# EAGLE design TBController_Teensy_3_2 (EAGLE 6.5.0)
COMPANY: ADAFRUIT INDUSTRIES; DRAWN: KTOWN; REV: B
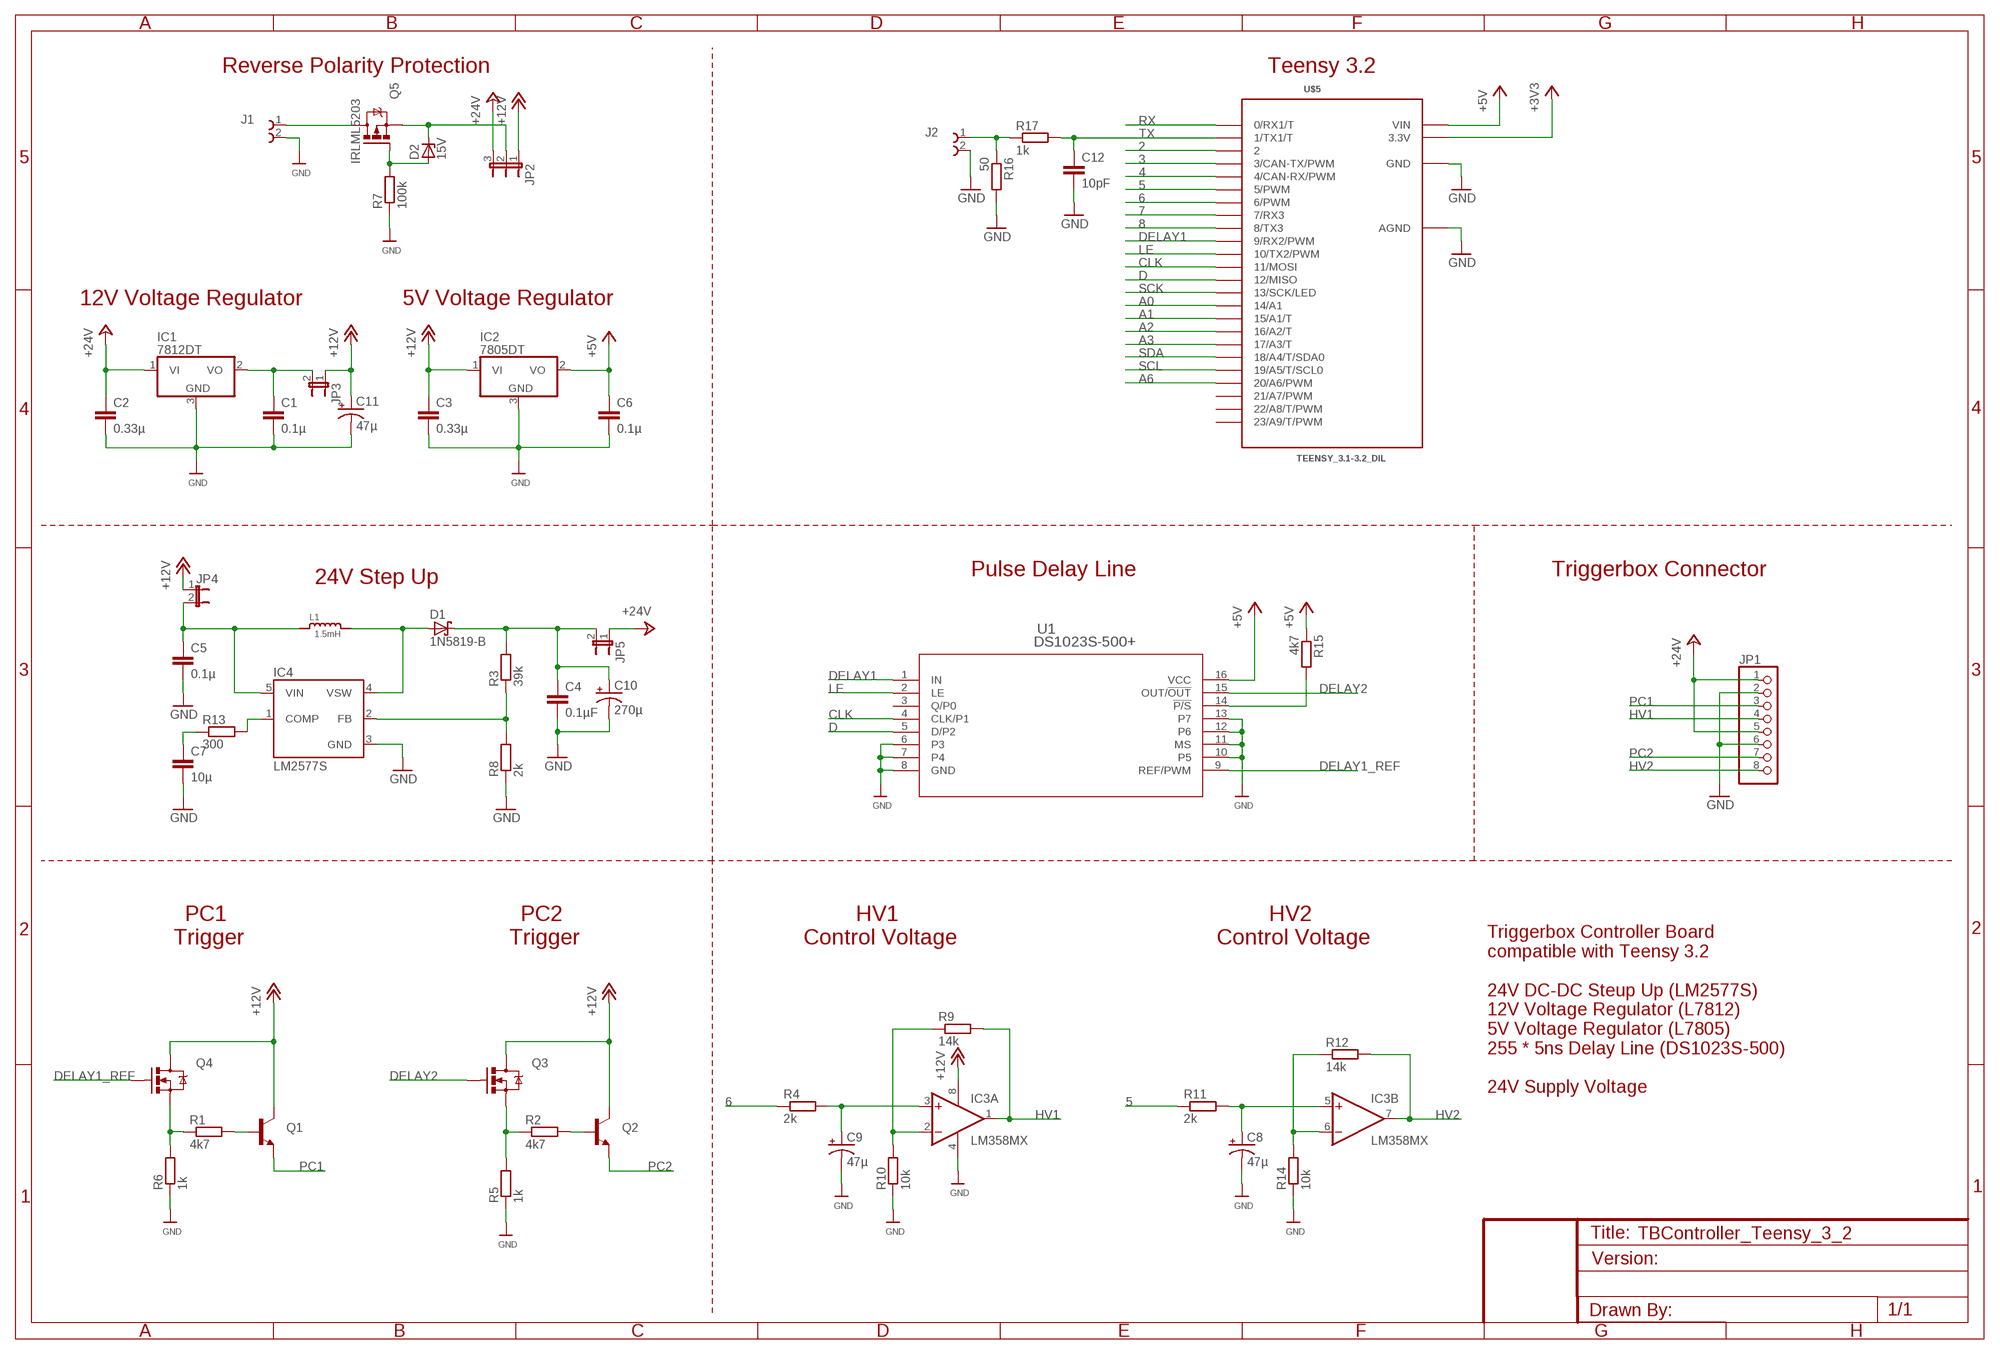
[diagram p0: schematic, sheet 1]

## Parts
C1  0.1µ  C-EUC0805K  [C0805K]
C2  0.33µ  C-EUC0805K  [C0805K]
C3  0.33µ  C-EUC0805K  [C0805K]
C4  0.1µF  C-EUC0805K  [C0805K]
C5  0.1µ  C-EUC0805K  [C0805K]
C6  0.1µ  C-EUC0805K  [C0805K]
C7  10µ  C-EUC0805K  [C0805K]
C8  47µ  CAP_POLPTH1  [CPOL-RADIAL-100UF-25V]
C9  47µ  CAP_POLPTH1  [CPOL-RADIAL-100UF-25V]
C10  270µ  CAP_POLPTH1  [CPOL-RADIAL-100UF-25V]
C11  47µ  CAP_POLPTH1  [CPOL-RADIAL-100UF-25V]
C12  10pF  C-EUC0805K  [C0805K]
D1  1N5819-B  [DO41-7.6]
D2  15V  ZENER-DIODESOT23  [SOT23]
IC1  7812DT  [TO252]
IC2  7805DT  [TO252]
IC3  LM358MX  [SO08]
IC4  LM2577S  [TO263-5]
J1  691103110002  [691103110002]
J2  691103110002  [691103110002]
JP1  PINHD-1X8  [1X08]
JP2  JP2E  [JP2]
JP3  JUMPER-2PTH_LOCK  [1X02_LOCK]
JP4  JUMPER-2PTH_LOCK  [1X02_LOCK]
JP5  JUMPER-2PTH_LOCK  [1X02_LOCK]
L1  1.5mH  SPULE  [WUERTH_WE_PD]
Q1  TRANSISTOR_NPNSOT23  [SOT23]
Q2  TRANSISTOR_NPNSOT23  [SOT23]
Q3  MOSFET-NCHANNELSMD  [SOT23-3]
Q4  MOSFET-NCHANNELSMD  [SOT23-3]
Q5  IRLML5203  [MICRO3]
R1  4k7  R-EU_R0805  [R0805]
R2  4k7  R-EU_R0805  [R0805]
R3  39k  R-EU_R0805  [R0805]
R4  2k  R-EU_R0805  [R0805]
R5  1k  R-EU_R0805  [R0805]
R6  1k  R-EU_R0805  [R0805]
R7  100k  R-EU_R0805  [R0805]
R8  2k  R-EU_R0805  [R0805]
R9  14k  R-EU_R0805  [R0805]
R10  10k  R-EU_R0805  [R0805]
R11  2k  R-EU_R0805  [R0805]
R12  14k  R-EU_R0805  [R0805]
R13  300  R-EU_R0805  [R0805]
R14  10k  R-EU_R0805  [R0805]
R15  4k7  R-EU_R0805  [R0805]
R16  50  R-EU_R0805  [R0805]
R17  1k  R-EU_R0805  [R0805]
U1  DS1023S-500+  [21-0042B_16]
U$5  TEENSY_3.1-3.2_DIL  [TEENSY_3.0-3.2&LC_DIL]

## Nets
2: U$5.2
3: U$5.3(3/CAN-TX/PWM)
4: U$5.4(4/CAN-RX/PWM)
5: R11.1 U$5.5(5/PWM)
6: R4.1 U$5.6(6/PWM)
7: U$5.7(7/RX3)
8: U$5.8(8/TX3)
+3V3: U$5.3.3V
+5V: C6.1 IC2.2(VO) R15.1 U1.16(VCC) U$5.VIN
+12V: C3.1 C11.1(+) IC2.1(VI) IC3.8(P:V+) JP2.1 JP3.1 JP4.1 Q1.3(C) Q2.3(C) Q3.3(D) Q4.3(D)
+24V: C2.1 IC1.1(VI) JP1.1 JP1.5 JP2.3 JP5.1
A0: U$5.14/A0(14/A1)
A1: U$5.15/A1(15/A1/T)
A2: U$5.16/A2(16/A2/T)
A3: U$5.17/A3(17/A3/T)
A6: U$5.20/A6(20/A6/PWM)
CLK: U1.4(CLK/P1) U$5.11(11/MOSI)
D: U1.5(D/P2) U$5.12(12/MISO)
DELAY1: U1.1(IN) U$5.9(9/RX2/PWM)
DELAY1_REF: Q4.1(G) U1.9(REF/PWM)
DELAY2: Q3.1(G) U1.15(OUT/!OUT)
GND: C1.2 C2.2 C3.2 C4.2 C5.2 C6.2 C7.2 C8.2(-) C9.2(-) C10.2(-) C11.2(-) C12.2 IC1.3(GND) IC2.3(GND) IC3.4(P:V-) IC4.3(GND) J1.2 J2.2 JP1.2 JP1.6 R5.1 R6.1 R7.1 R8.1 R10.1 R14.1 R16.2 U1.6(P3) U1.7(P4) U1.8(GND) U1.10(P5) U1.11(MS) U1.12(P6) U1.13(P7) U$5.AGND U$5.GND
HV1: IC3.1(A:OUT) JP1.4 R9.2
HV2: IC3.7(B:OUT) JP1.8 R12.2
LE: U1.2(LE) U$5.10(10/TX2/PWM)
N$1: Q3.2(S) R2.1 R5.2
N$2: C12.1 R17.2 U$5.1(1/TX1/T)
N$3: C9.1(+) IC3.3(A:+IN) R4.2
N$4: J1.1 Q5.3(D)
N$5: D2.1(A) Q5.1(G) R7.2
N$6: IC3.2(A:-IN) R9.1 R10.2
N$7: R15.2 U1.14(!P/S)
N$8: Q4.2(S) R1.1 R6.2
N$9: Q1.1(B) R1.2
N$10: Q2.1(B) R2.2
N$11: D1.A IC4.4(VSW) L1.2
N$12: C7.1 R13.1
N$13: IC4.1(COMP) R13.2
N$14: IC4.2(FB) R3.1 R8.2
N$15: D2.3(C) JP2.2 Q5.2(S)
N$16: C8.1(+) IC3.5(B:+IN) R11.2
N$17: IC3.6(B:-IN) R12.1 R14.2
N$18: C1.1 IC1.2(VO) JP3.2
N$19: C5.1 IC4.5(VIN) JP4.2 L1.1
N$20: C4.1 C10.1(+) D1.C JP5.2 R3.2
PC1: JP1.3 Q1.2(E)
PC2: JP1.7 Q2.2(E)
RX: U$5.0(0/RX1/T)
SCK: U$5.13(13/SCK/LED)
SCL: U$5.19/A5(19/A5/T/SCL0)
SDA: U$5.18/A4(18/A4/T/SDA0)
TX: J2.1 R16.1 R17.1
Unconnected: U1.3(Q/P0) U$5.21/A7(21/A7/PWM) U$5.22/A8(22/A8/T/PWM) U$5.23/A9(23/A9/T/PWM)

## Notes on the sheet
- Reverse Polarity Protection | Teensy 3.2
- 12V Voltage Regulator | 5V Voltage Regulator
- 24V Step Up | Pulse Delay Line | Triggerbox Connector
- PC1 
  Trigger
- PC2 
  Trigger
- HV1 
  Control Voltage
- HV2 
  Control Voltage
- Triggerbox Controller Board
  compatible with Teensy 3.2
  
  24V DC-DC Steup Up (LM2577S)
  12V Voltage Regulator (L7812)
  5V Voltage Regulator (L7805)
  255 * 5ns Delay Line (DS1023S-500)
  
  24V Supply Voltage

## Library data of the parts
C1-C7 C12 = rcl:C-EU: CAPACITOR, European symbol
C8-C11 = SparkFun:CAP_POL: Capacitor Polarized These are standard SMD and PTH capacitors. Normally 10uF, 47uF, and 100uF in electrolytic and tantalum varieties. Always verify the external diameter of the through hole cap, it varies with capacity, voltage, and manufacturer. The EIA devices should be standard.
D1 = diode:1N581*: 1.0A SCHOTTKY BARRIER RECTIFIER Source: http://www.diodes.com/datasheets/ds23001.pdf
D2 = diode-1:ZENER-DIODE: Z-Diode
IC1 IC2 = linear:78*: Positive VOLTAGE REGULATOR Source: http://cache.national.com/ds/LM/LM78L05.pdf http://www.fairchildsemi.com/ds/LM/LM7805.pdf
IC3 = linear:LM358: OP AMP also LM158; LM258; LM2904 Source: http://cache.national.com/ds/LM/LM158.pdf
IC4 = v-reg-3:LM2577: National Semiconductor <http://www.national.com> 3.0A Step-Up "Simple Switcher"(c) 3.0A 65V NPN switch, step-up regulator
J1 J2 = EAGLE-TERMINAL_BLOCKS-rev16e:691103110002: WR-TBL Serie 1031 - 3.5mm Horizontal Entry Modular with Pressure Clamp - 1.5mm2 Wires, 2 Pins=>Code : Con_TBL_Screw_PressureClamp_6911103110002 <http://katalog.we-online.de/media/images/eican/Con_TBL_Screw_PressureClamp_69111031100xx_pf2.jpg> Details see: http://katalog.we-online.de/en/em/691_103_110_0xx Created 2014-06-16, Karrer Zheng 2014 (C) Würth Elektronik
JP1 = pinhead:PINHD-1X8: PIN HEADER
JP2 = jumper:JP2E: JUMPER
JP3-JP5 = SparkFun:JUMPER-2: Jumper Basic 0.1" spaced jumper. Use with breakaway headers.
L1 = SPULE:SPULE: Generic Inductors WE-PD Wuerth Electronics RS Best.-Nr. 789-6785; 7447709152: 1.5mH 650mA; BESTNR: 7447709152
Q1 Q2 = SparkFun:TRANSISTOR_NPN: Transistor NPN BJT configuration in SOT23 package. MMBT2222 is the common NPN we use. Double check BCE configuration again layout.
Q3 Q4 = SparkFun:MOSFET-NCHANNEL
Q5 = transistor-power:IRLML5203: HEXFET P-Channel Power MOSFET
R1-R17 = rcl:R-EU_: RESISTOR, European symbol
U1 = DS1023:DS1023S-500+; MANUFACTURER_PART_NUMBER: DS1023S500+; VENDOR: Maxim Integrated Products
U$5 = Teensy_3_and_LC_Series_Boards_v1.4:TEENSY_3.1-3.2_DIL: Teensy 3.1 or 3.2 in a DIL Layout.

## Board
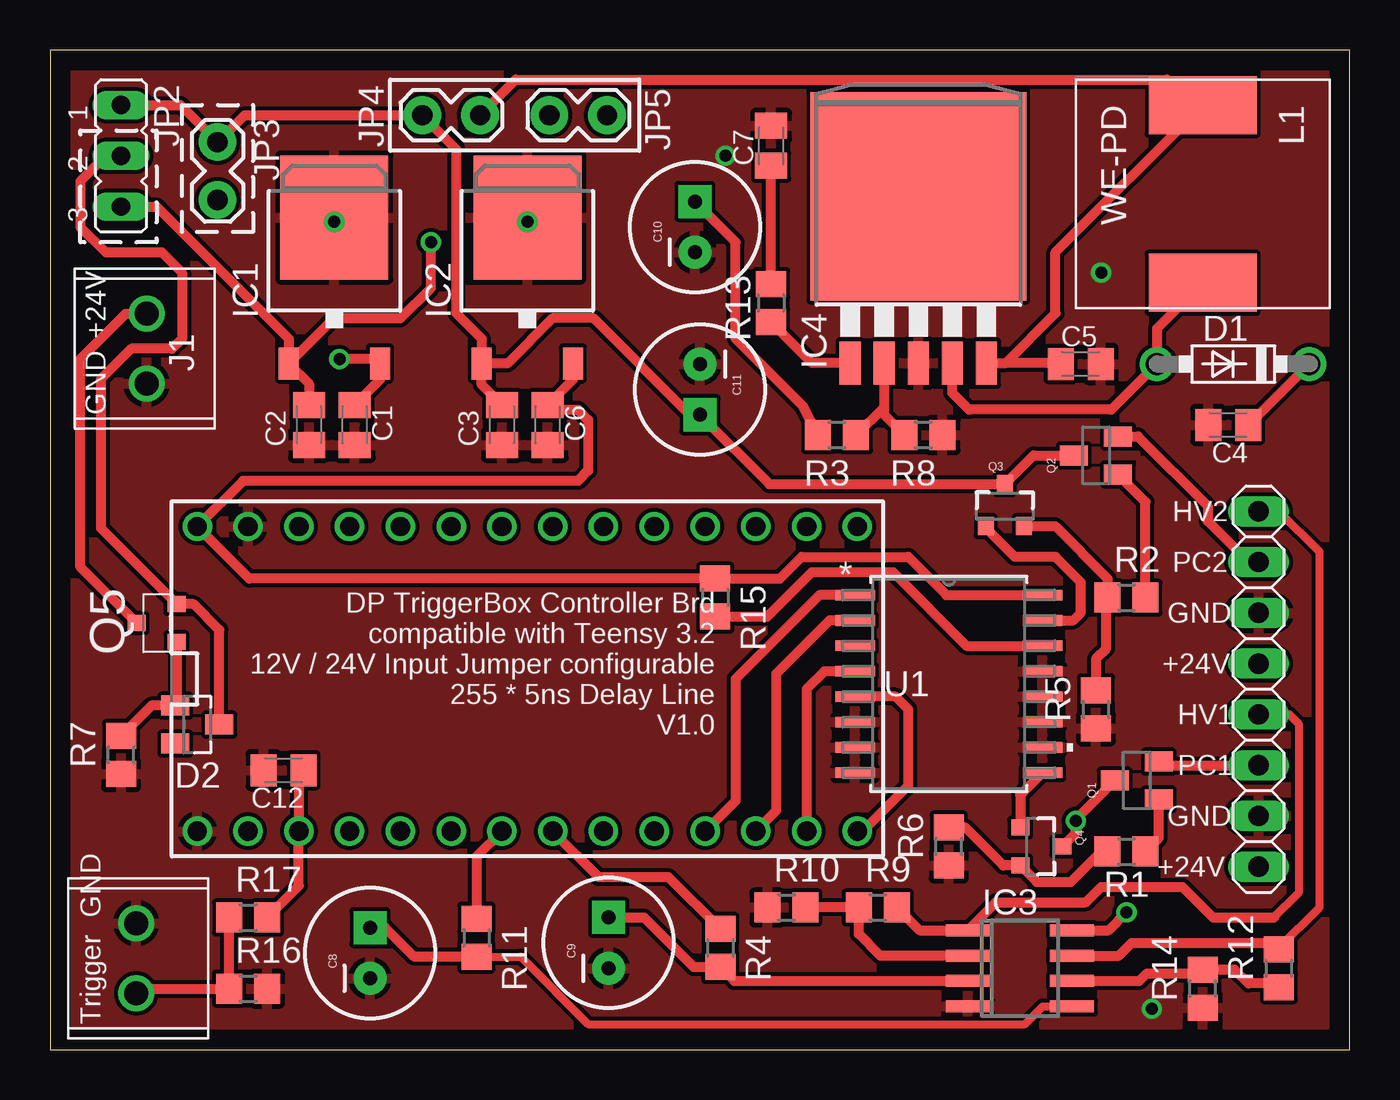
[diagram p1: board, top side]
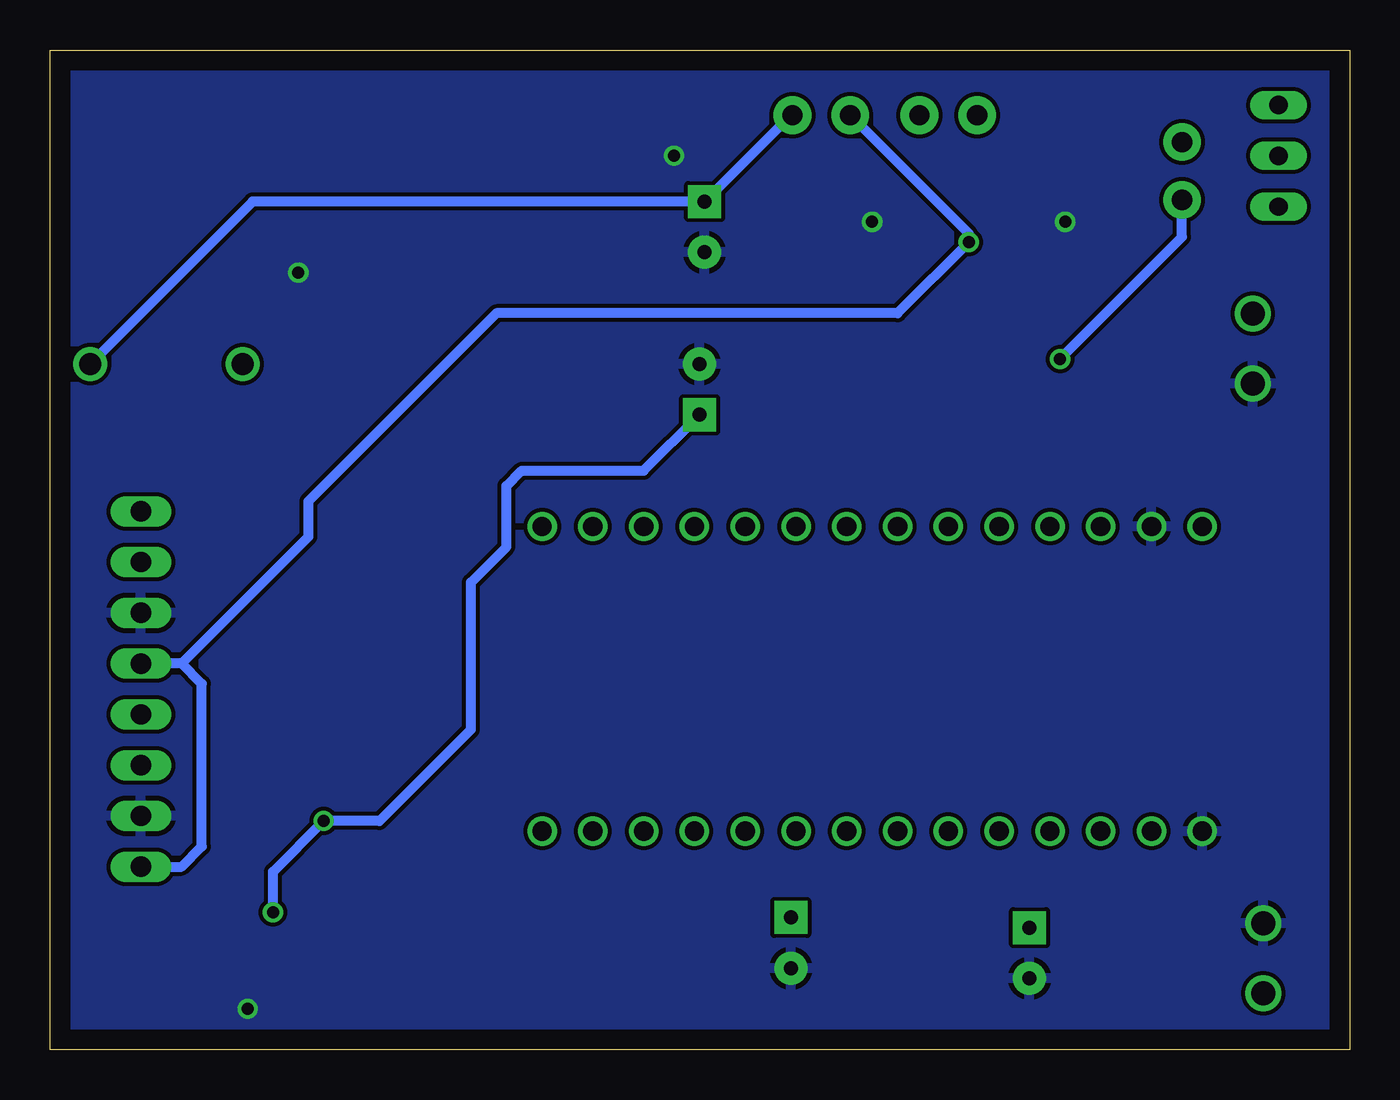
[diagram p2: board, bottom side, seen from below]

Size 65 x 50 mm. Coordinates in mm from the lower left corner, seen from the top.
Outline: 0,0 65,0 65,50 0,50 0,0
Copper layers (1*16): Top 0.035mm / dielectric 1.5mm / Bottom 0.035mm
Design rules "default *": minimum track width 0.25mm, minimum drill 0.5mm, track to track 0.2mm, track to pad 0.2mm, pad to pad 0.2mm, via to via 0.2mm, smd to smd 0.2mm, copper to edge 40mil, drill to drill 8mil, minimum pad ring 10mil, minimum via ring 8mil, stop-mask expansion 4mil, vias tented up to drill 0mil, thermal gap 10mil

### Footprints (pad centres in the part's own frame; a part is rotated, then mirrored left to right if it is on the bottom)
C0805K = smd 1.3 x 1.6: 1 -1,0; 2 1,0
CPOL-RADIAL-100UF-25V = drill 0.7 pad 1.651 square: 1 1.27,0 | drill 0.7 pad 1.651: 2 -1.27,0
DO41-7.6 = drill 1.1 pad 1.7: A 3.81,0; C -3.81,0
SOT23 = smd 1 x 1.4: 1 -0.95,-1.1; 2 0.95,-1.1; 3 0,1.1
TO252 = smd 1 x 1.6: 1 -2.28,-4.8; 2 2.28,-4.8 | smd 5.4 x 6.2: 3 0,2.5
SO08 = smd 0.6 x 2.2: 1 -1.905,-2.6; 2 -0.635,-2.6; 3 0.635,-2.6; 4 1.905,-2.6; 5 1.905,2.6; 6 0.635,2.6; 7 -0.635,2.6; 8 -1.905,2.6
TO263-5 = smd 1.067 x 2.159: 1 -3.404,-5.791; 2 -1.702,-5.791; 3 0,-5.791; 4 1.702,-5.791; 5 3.404,-5.791 | smd 10.8 x 10.41: 6 0,2.54
691103110002 = drill 1.2: 1 -1.75,0; 2 1.75,0
1X08 = drill 1.016 long: 1 -8.89,0; 2 -6.35,0; 3 -3.81,0; 4 -1.27,0; 5 1.27,0; 6 3.81,0; 7 6.35,0; 8 8.89,0
JP2 = drill 0.914 long: 1 -2.54,0; 2 0,0; 3 2.54,0
1X02_LOCK = drill 1.016 pad 1.88: 1 -0.178,0; 2 2.718,0
WUERTH_WE_PD = smd 5.4 x 2.9: 1 0,0; 2 0,8.89
SOT23-3 = smd 0.8 x 0.9: 1 -0.95,-1; 2 0.95,-1; 3 0,1.1
MICRO3 = smd 0.8 x 0.9: 1 -0.95,-1; 2 0.95,-1; 3 0,1
R0805 = smd 1.3 x 1.5: 1 -0.95,0; 2 0.95,0
21-0042B_16 = smd 1.981 x 0.533: 1 -4.686,4.445; 2 -4.686,3.175; 3 -4.686,1.905; 4 -4.686,0.635; 5 -4.686,-0.635; 6 -4.686,-1.905; 7 -4.686,-3.175; 8 -4.686,-4.445; 9 4.686,-4.445; 10 4.686,-3.175; 11 4.686,-1.905; 12 4.686,-0.635; 13 4.686,0.635; 14 4.686,1.905; 15 4.686,3.175; 16 4.686,4.445
TEENSY_3.0-3.2&LC_DIL = drill 0.965: 0 -7.62,13.97; 1 -7.62,11.43; 2 -7.62,8.89; 3 -7.62,6.35; 3.3V 7.62,11.43; 4 -7.62,3.81; 5 -7.62,1.27; 6 -7.62,-1.27; 7 -7.62,-3.81; 8 -7.62,-6.35; 9 -7.62,-8.89; 10 -7.62,-11.43; 11 -7.62,-13.97; 12 -7.62,-16.51; 13 7.62,-16.51; 14/A0 7.62,-13.97; 15/A1 7.62,-11.43; 16/A2 7.62,-8.89; 17/A3 7.62,-6.35; 18/A4 7.62,-3.81; 19/A5 7.62,-1.27; 20/A6 7.62,1.27; 21/A7 7.62,3.81; 22/A8 7.62,6.35; 23/A9 7.62,8.89; AGND 7.62,13.97; GND -7.62,16.51; VIN 7.62,16.51

### Placement (x,y rotation side)
C1  15.24,31.24 270 top
C2  12.95,31.24 270 top
C3  22.61,31.24 270 top
C4  58.93,31.24 180 top
C5  51.56,34.29 0 top
C6  24.89,31.24 270 top
C7  36.07,45.21 90 top
C8  16,4.83 90 top
C9  27.94,5.33 90 top
C10  32.26,41.15 90 top
C11  32.51,33.02 270 top
C12  11.68,13.97 180 top
D1  59.18,34.29 180 top
D2  7.37,16.26 270 top
IC1  14.22,39.12 0 top
IC2  23.88,39.12 0 top
IC3  48.51,4.06 270 top
IC4  43.43,40.13 0 top
J1  4.83,35.05 270 top
J2  4.32,4.57 90 top
JP1  60.45,18.03 90 top
JP2  3.56,44.7 270 top
JP3  8.38,45.21 270 top
JP4  18.8,46.74 0 top
JP5  25.15,46.74 0 top
L1  57.66,47.24 180 top
Q1  54.36,13.46 90 top
Q2  52.32,29.72 90 top
Q3  47.75,27.18 0 top
Q4  49.53,10.16 270 top
Q5  5.33,21.34 90 top
R1  53.85,9.91 0 top
R2  53.85,22.61 0 top
R3  39.37,30.73 180 top
R4  33.53,5.08 270 top
R5  52.32,17.02 90 top
R6  44.96,10.16 90 top
R7  3.56,14.73 90 top
R8  43.69,30.73 180 top
R9  41.4,7.11 0 top
R10  36.83,7.11 0 top
R11  21.34,5.59 270 top
R12  61.47,4.06 90 top
R13  36.07,37.34 270 top
R14  57.66,3.05 90 top
R15  33.27,22.61 270 top
R16  9.91,3.05 0 top
R17  9.91,6.6 0 top
U1  44.96,18.29 0 top
U$5  23.88,18.54 90 top

### Tracks (layer width: path | path; a pad name or v marks a point on that pad's centre or on a via)
5
  Top 0.5: U$5.5 21.34,9.65 R11.1
6
  Top 0.5: U$5.6 27.43,8.64 30.92,8.64 R4.1
+5V
  Top 0.5: IC2.2 26.16,33.51 C6.1 25.13,32 26.42,32 26.92,31.5 26.92,28.96 26.42,28.45 9.65,28.45 U$5.VIN 9.97,23.56 R15.1 36.51,23.56 37.59,24.64 42.93,24.64 44.83,22.73 U1.16
+12V  (via drill 0.6)
  Top 0.5: IC2.1 21.6,35.55 20.32,36.83 20.32,45.03 JP4.1 9.73,46.74 JP3.1 6.53,47.24 JP2.1 | C3.1 21.6,33.25 IC2.1 | IC3.8 52.96,5.97 v53.85,6.86 | Q1.3 51.31,11.51 v51.31,11.43 51.31,10.84 Q4.3 | IC2.1 22.89,34.32 25.15,36.58 27.18,36.58 32,31.75 C11.1 35.98,28.28 Q3.3 49.19,29.72 Q2.3 51.22,29.97
  Bottom 0.5: v53.85,6.86 53.85,8.89 v51.31,11.43 48.51,11.43 43.94,16 43.94,23.37 42.16,25.15 42.16,28.19 41.4,28.96 35.31,28.96 C11.1
+24V  (via drill 0.6)
  Top 0.5: 11.94,34.54 IC1.1 | IC1.1 14.2,36.58 17.53,36.58 19.05,38.1 v19.05,40.39 | IC1.1 12.95,33.31 C2.1 | JP2.3 5.33,42.16 11.94,35.55 IC1.1
  Bottom 0.5: 58.42,19.3 JP1.5 | JP1.1 58.42,9.14 57.4,10.16 57.4,18.29 58.42,19.3 | 58.42,19.3 52.07,25.65 52.07,27.43 42.67,36.83 22.61,36.83 v19.05,40.39 19.05,40.82 JP5.1
CLK
  Top 0.5: U1.4 38.73,18.92 37.85,18.03 U$5.11
D
  Top 0.5: U$5.12 40.64,10.92 42.93,13.21 42.93,17.02 42.29,17.65 U1.5
DELAY1
  Top 0.5: U1.1 38.48,22.73 34.29,18.54 34.29,12.45 U$5.9
DELAY1_REF
  Top 0.5: U1.9 48.53,12.73 Q4.1
DELAY2
  Top 0.5: U1.15 51.18,21.46 51.56,21.84 51.56,23.37 50.29,24.64 48.26,24.64 46.8,26.1 Q3.1
GND  (via drill 0.6)
  other vias: 55.12,2.03 14.22,41.4 23.88,41.4 52.58,38.86 33.78,44.7
  pour Bottom: 0,50.04 65.02,50.04 65.02,0 0,0
  pour Top: 0,50.04 65.02,50.04 65.02,0 0,0
HV1
  Top 0.406: 61.21,6.6 62.48,7.87 62.48,16.26 61.98,16.76 JP1.4
  Top 0.5: R9.2 43.49,5.97 IC3.1 47.31,7.37 51.82,7.37 52.58,8.13 56.64,8.13 58.17,6.6 61.21,6.6
HV2
  Top 0.406: 61.47,5.08 63.5,7.11 63.5,24.89 61.47,26.92 JP1.8
  Top 0.5: IC3.7 53.47,4.7 54.1,5.33 61.15,5.33 R12.2 61.47,5.08
LE
  Top 0.5: U1.2 38.99,21.46 36.32,18.8 36.32,11.94 U$5.10
N$1
  Top 0.5: R5.2 52.32,19.56 52.83,20.07 52.83,22.54 R2.1 52.9,23.56 50.28,26.18 Q3.2
N$2
  Top 0.5: R17.2 12.45,8.19 U$5.1 12.45,13.73 C12.1
N$3
  Top 0.5: C9.1 29.72,6.6 32.19,4.13 R4.2 34.23,3.43 IC3.3
N$4
  Top 0.5: Q5.3 1.52,24.15 1.52,34.54 3.78,36.8 J1.1
N$5
  Top 0.5: Q5.1 6.33,17.27 D2.1 5.08,17.21 R7.2
N$6
  Top 0.5: IC3.2 41.53,4.7 40.45,5.78 R9.1 R10.2
N$7
  Top 0.5: R15.2 35.88,21.66 38.1,23.88 42.16,23.88 45.85,20.19 U1.14
N$8
  Top 0.5: R1.1 52.58,9.91 51.05,8.38 49.36,8.38 Q4.2 47.69,9.21 45.79,11.11 R6.2
N$9
  Top 0.5: R1.2 55.46,10.56 Q1.1
N$10
  Top 0.5: R2.2 54.8,27.39 Q2.1
N$11
  Top 0.5: L1.2 55.37,36.07 D1.A 53.09,32 45.97,32 45.14,32.84 IC4.4
N$12
  Top 0.5: R13.1 C7.1
N$13
  Top 0.5: IC4.1 38.12,34.34 R13.2
N$14
  Top 0.5: R3.1 41.73,32.15 | 41.73,32.15 41.73,32.26 IC4.2 | R8.2 41.73,31.74 41.73,32.15
N$15
  Top 0.5: D2.3 8.47,21 7.18,22.29 Q5.2 2.54,26.08 2.54,33.53 4.06,35.05 6.1,35.05 6.6,35.56 6.6,38.86 5.59,39.88 2.79,39.88 1.52,41.15 1.52,43.43 2.79,44.7 JP2.2
N$16
  Top 0.406: R11.2 23.56,4.64 26.92,1.27 48.77,1.27 49.66,2.16 IC3.5
  Top 0.5: R11.2 18.22,4.64 16.76,6.1 C8.1
N$17
  Top 0.5: IC3.6 54.48,3.43 54.86,3.81 57.47,3.81 R14.2 59.25,4 59.94,3.3 61.28,3.3 R12.1
N$18  (via drill 0.6)
  Top 0.5: C1.1 16.5,33.51 IC1.2 16.28,34.54 v14.48,34.54
  Bottom 0.5: v14.48,34.54 8.38,40.64 JP3.2
N$19
  Top 0.5: IC4.5 47.8,34.34 | 47.8,34.34 50.29,36.83 50.29,39.88 L1.1 57.15,47.24 55.88,48.51 23.29,48.51 JP4.2 | C5.1 50.51,34.34 47.8,34.34
N$20
  Top 0.5: R3.2 37.66,32.19 34.29,35.56 34.29,40.39 C10.1 | C4.1 62.98,34.29 D1.C
  Bottom 0.5: D1.C 54.86,42.42 C10.1 27.94,46.74 JP5.2
PC1
  Top 0.5: Q1.2 55.64,14.22 JP1.3
PC2
  Top 0.5: JP1.7 59.96,24.38 57.91,26.43 57.91,27.18 54.42,30.67 Q2.2
TX
  Top 0.5: J2.1 4.54,3.05 R16.1 R17.1

### Text on the board
tNames: +24V | GND | HV2 | PC2 | DP TriggerBox Controller Brd / compatible with Teensy 3.2 / 12V / 24V Input Jumper configurable / 255 * 5ns Delay Line / V1.0 | GND | +24V | HV1 | PC1 | GND | +24V | GND | Trigger